# EAGLE design galaxydriveV3.5 (EAGLE 9.5.2)
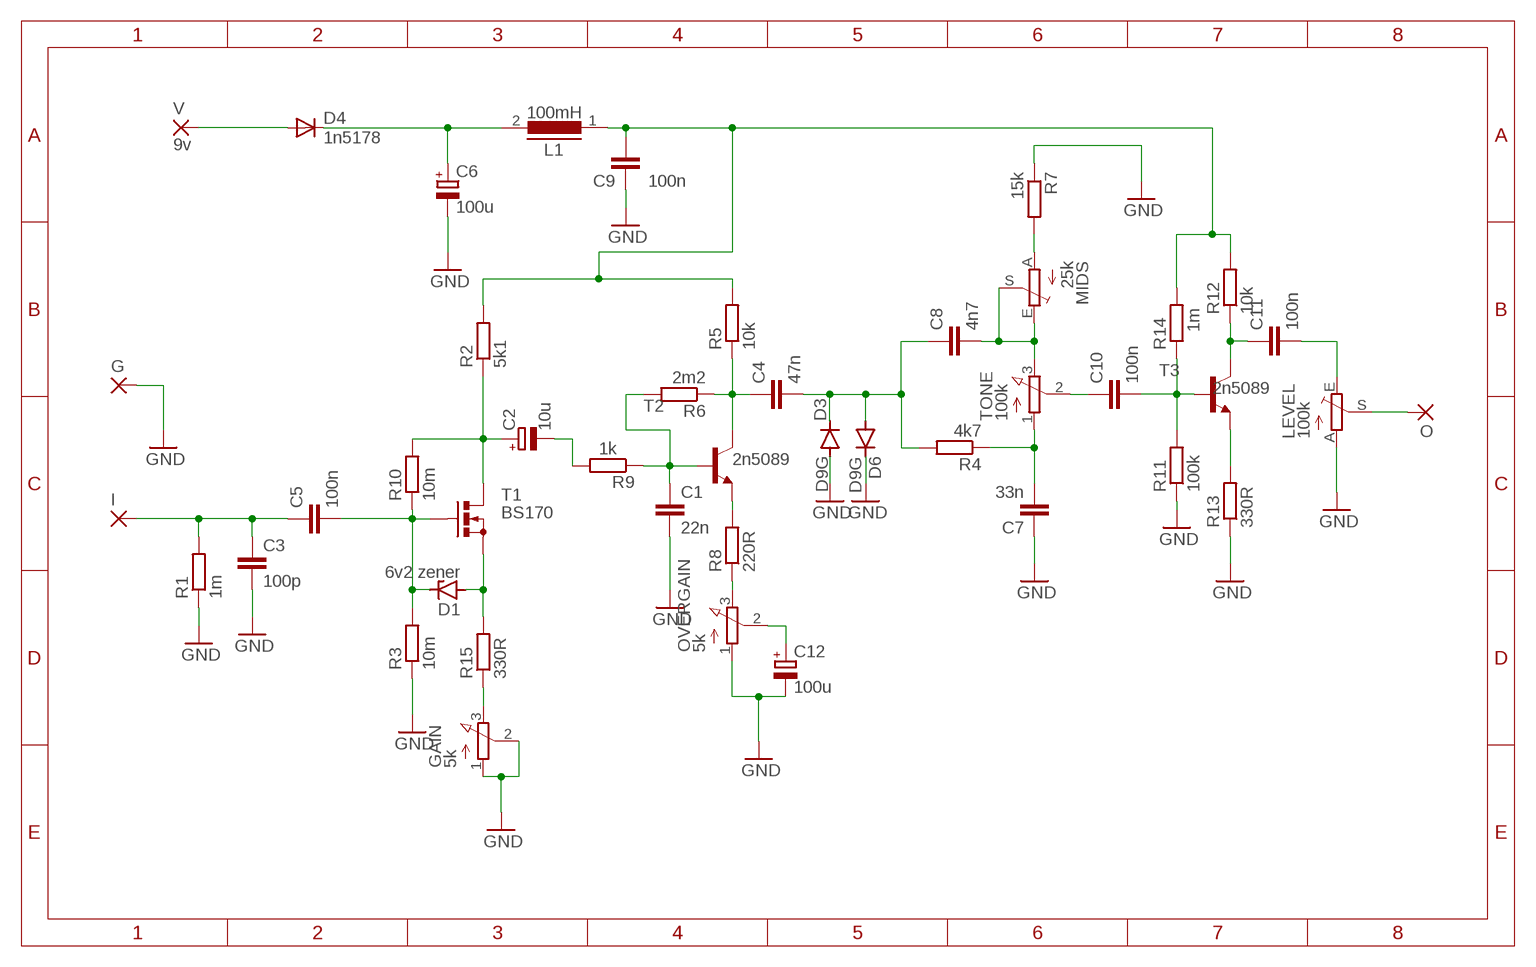
[diagram p0: schematic, sheet 1]

## Parts
C1  22n  C5/2.5  [C5B2.5]
C2  10u  CPOL-EUE1.8-4  [E1,8-4]
C3  100p  C5/2.5  [C5B2.5]
C4  47n  C5/2.5  [C5B2.5]
C5  100n  C5/2.5  [C5B2.5]
C6  100u  CPOL-EUE2-4  [E2-4]
C7  33n  C5/2.5  [C5B2.5]
C8  4n7  C5/2.5  [C5B2.5]
C9  100n  C5/2.5  [C5B2.5]
C10  100n  C5/2.5  [C5B2.5]
C11  100n  C5/2.5  [C5B2.5]
C12  100u  CPOL-EUE2-4  [E2-4]
D1  6v2 zener  BZX90  [DO34Z7]
D3  D9G  OA91  [DO07]
D4  1n5178  DIODE-D-7.5  [D-7.5]
D6  D9G  OA91  [DO07]
G  2,15/1,0  [2,15/1,0]
GAIN  5k  HEXPOT1  [3RP/1610N]
I  2,15/1,0  [2,15/1,0]
L1  100mH  MCC10  [MCC10]
LEVEL  100k  TRIM_EU-B25P  [B25P]
MIDS  25k  TRIM_EU-B25P  [B25P]
O  2,15/1,0  [2,15/1,0]
OVERGAIN  5k  HEXPOT1  [3RP/1610N]
R1  1m  R-EU_0207/7  [0207/7]
R2  5k1  R-EU_0207/7  [0207/7]
R3  10m  R-EU_0207/7  [0207/7]
R4  4k7  R-EU_0207/7  [0207/7]
R5  10k  R-EU_0207/7  [0207/7]
R6  2m2  R-EU_0207/7  [0207/7]
R7  15k  R-EU_0207/7  [0207/7]
R8  220R  R-EU_0207/7  [0207/7]
R9  1k  R-EU_0207/7  [0207/7]
R10  10m  R-EU_0207/7  [0207/7]
R11  100k  R-EU_0207/7  [0207/7]
R12  10k  R-EU_0207/7  [0207/7]
R13  330R  R-EU_0207/7  [0207/7]
R14  1m  R-EU_0207/7  [0207/7]
R15  330R  R-EU_0207/7  [0207/7]
T1  BS170  [SOT54E]
T2  2n5089  2N3904  [TO92]
T3  2n5089  2N3904  [TO92]
TONE  100k  HEXPOT1  [3RP/1610N]
V  9v  2,15/1,0  [2,15/1,0]

## Nets
GND: C1.2 C3.2 C6.- C7.1 C9.1 C12.- D3.A D6.C G.1(P) GAIN.1(A) GAIN.2(S) LEVEL.A OVERGAIN.1(A) R1.1 R3.1 R7.1 R11.1 R13.1
N$1: C2.+ R2.1 R10.2 T1.D
N$2: C4.2 C8.1 D3.C D6.A R4.2
N$3: C5.2 D1.C R3.2 R10.1 T1.G
N$4: D1.A R15.2 T1.S
N$5: C9.2 L1.1 R2.2 R5.2 R12.2 R14.2
N$6: C2.- R9.2
N$7: C8.2 MIDS.E MIDS.S TONE.3(E)
N$8: R8.2 T2.3(E)
N$9: C7.2 R4.1 TONE.1(A)
N$10: C3.1 C5.1 I.1(P) R1.2
N$11: C10.2 R11.2 R14.1 T3.2(B)
N$12: OVERGAIN.3(E) R8.1
N$13: C12.+ OVERGAIN.2(S)
N$14: C1.1 R6.2 R9.1 T2.2(B)
N$15: C11.1 R12.1 T3.1(C)
N$16: C4.1 R5.1 R6.1 T2.1(C)
N$18: R13.2 T3.3(E)
N$19: MIDS.A R7.2
N$20: GAIN.3(E) R15.1
N$21: LEVEL.S O.1(P)
N$22: C10.1 TONE.2(S)
N$23: C11.2 LEVEL.E
N$27: C6.+ D4.C L1.2
N$28: D4.A V.1(P)

## Library data of the parts
C1 C3-C5 C7-C11 = hexcapacitor-wima:C: CAPACITOR naming: grid - package width
C2 C6 C12 = hexresistor:CPOL-EU: POLARIZED CAPACITOR, European symbol; SPICEPREFIX: C
D1 = diode:BZX90: Z DIODE
D3 D6 = diode:OA91: DIODE germanium signal diode 115 V 50 mA
D4 = diode-1:DIODE-: DIODE
G I O V = wirepad:2,15/1,0: THROUGH-HOLE PAD
GAIN OVERGAIN TONE = hexpedalpot:HEXPOT1: 16mm Potentiometer one level Source: http://www.alphapotentiometers.net/html/16mm_pot_2.html
L1 = inductors:MCC10: INDUCTOR; SPICEPREFIX: L
LEVEL MIDS = hexpedalpot16mm low pro:TRIM_EU-: POTENTIOMETER
R1-R15 = hexresistor:R-EU_: RESISTOR, European symbol; SPICEPREFIX: R
T1 = transistor-small-signal:BS170: N-CHANNEL MOS FET
T2 T3 = transistor:2N3904: NPN TRANSISTOR

## Net classes
0 default: width 0.254 mm

## Board
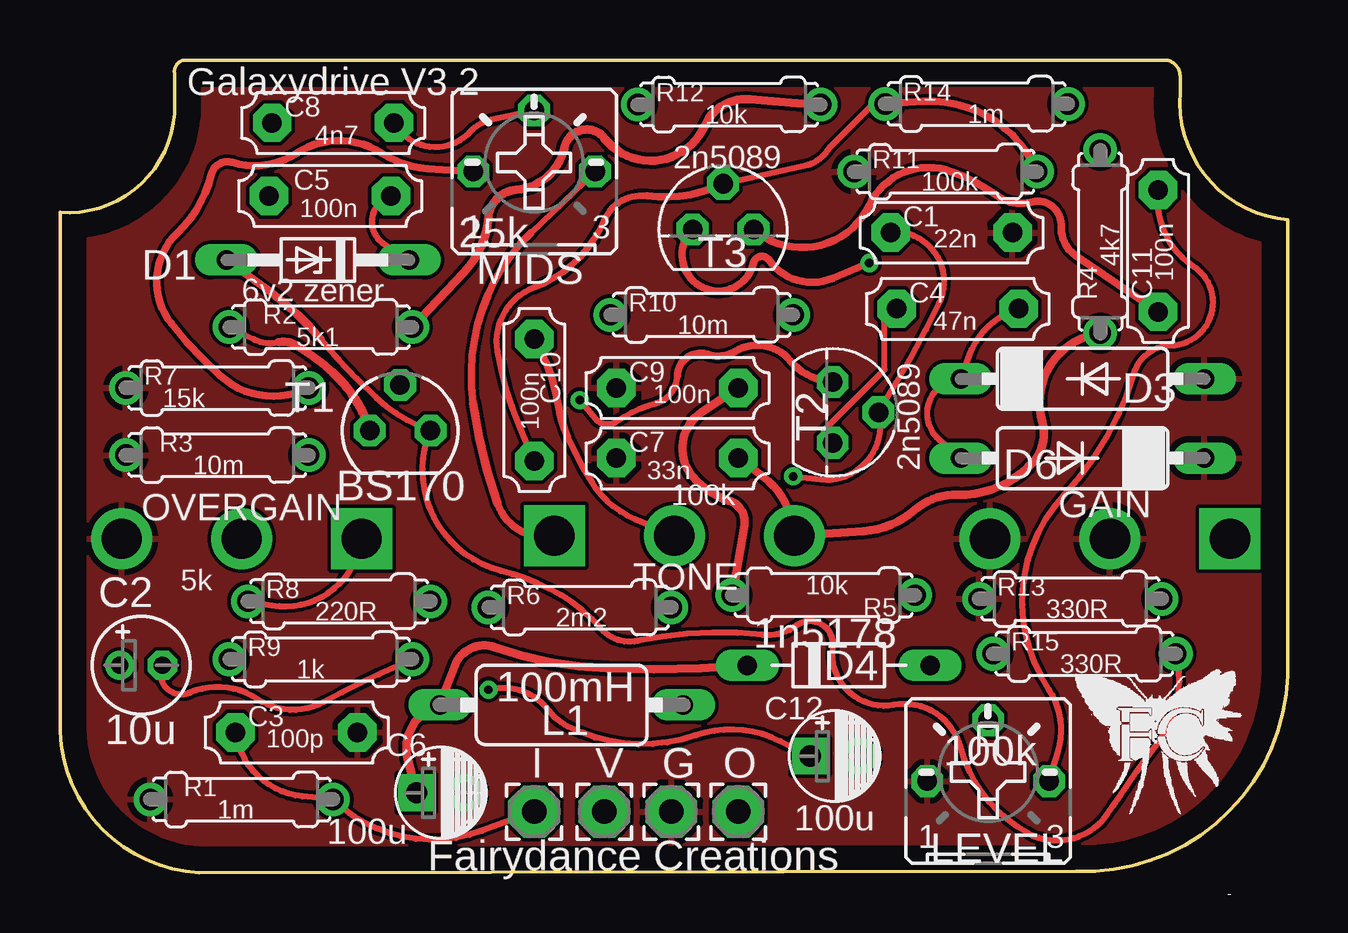
[diagram p1: board, top side]
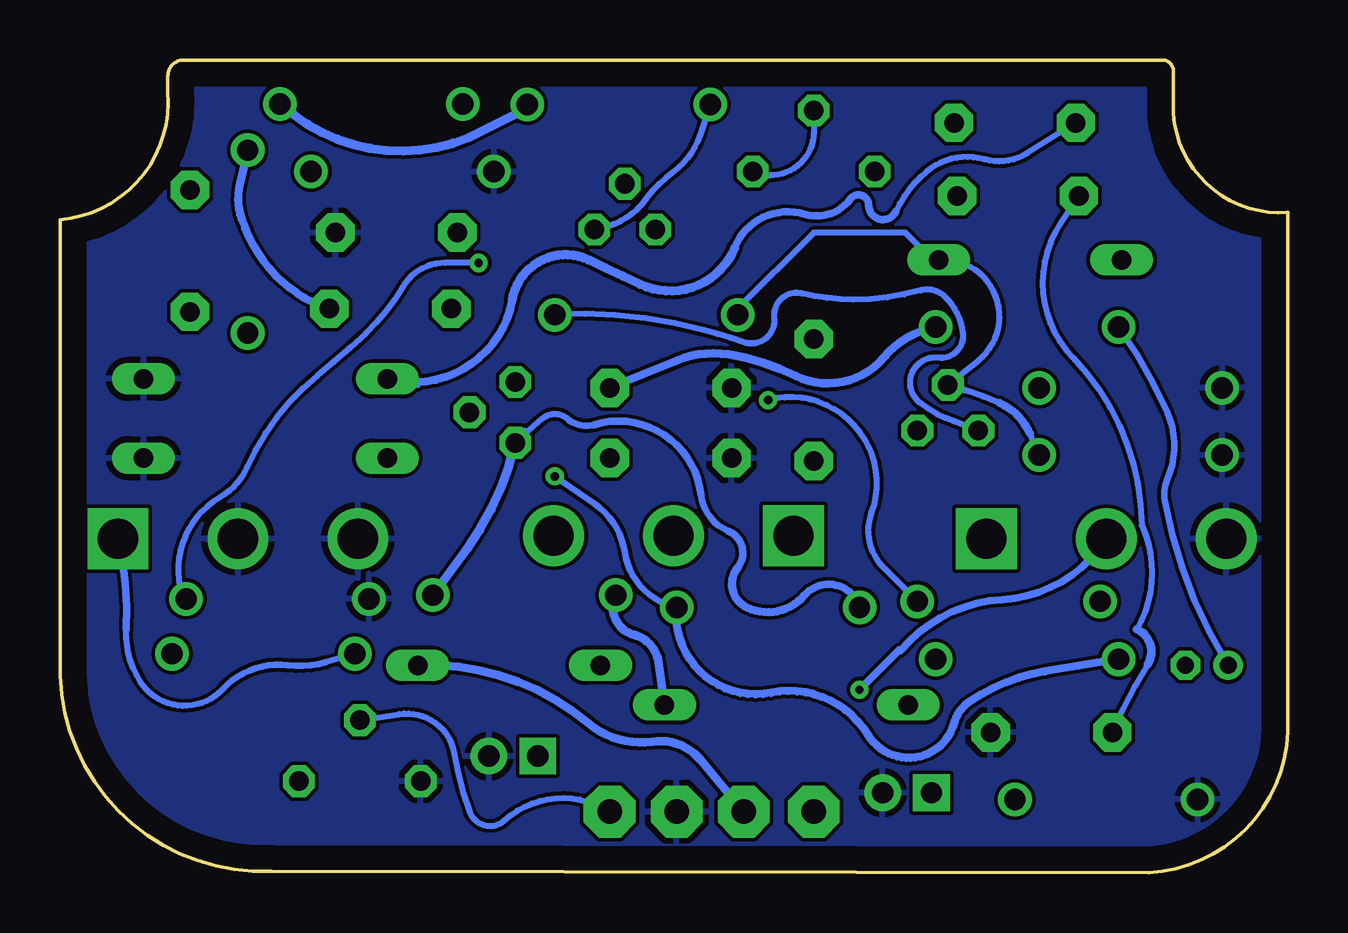
[diagram p2: board, bottom side, seen from below]

Size 51.18 x 33.86 mm. Coordinates in mm from the lower left corner, seen from the top.
Outline: 0,6.43 arc90 5.79,0 42.37,0.05 arc90 51.18,8.2 51.18,27.2 arc-90 46.69,32.51 46.69,33.15 arc90 46.05,33.86 5.16,33.86 arc90 4.78,33.27 4.78,31.62 arc-90 0,27.51 0,6.43
Copper layers (1*16): Top 0.035mm / dielectric 1.5mm / Bottom 0.035mm
Design rules "default": minimum track width 6mil, minimum drill 0.35mm, track to track 6mil, track to pad 6mil, pad to pad 6mil, via to via 6mil, smd to smd 6mil, copper to edge 40mil, drill to drill 6mil, minimum pad ring 10mil, minimum via ring 8mil, stop-mask expansion 4mil, vias tented up to drill 0mil, thermal gap 10mil

### Footprints (pad centres in the part's own frame; a part is rotated, then mirrored left to right if it is on the bottom)
C5B2.5 = drill 0.813 pad 1.6 octagon: 1 -2.54,0; 2 2.54,0
E1,8-4 = drill 0.711 pad 1.168: + -0.889,0 | drill 0.711 pad 1.168 octagon: - 0.889,0
E2-4 = drill 0.889 pad 1.524 square: + -1.016,0 | drill 0.889 pad 1.524: - 1.016,0
DO34Z7 = drill 0.813 long: A 3.81,0; C -3.81,0
DO07 = drill 0.813 long: A 5.08,0; C -5.08,0
D-7.5 = drill 0.813 long: A 3.81,0; C -3.81,0
2,15/1,0 = drill 1.016 pad 2.159 octagon: 1 0,0
3RP/1610N = drill 1.676 pad 2.54: 1 -5,0; 2 0,0 | drill 1.676 pad 2.54 square: 3 5,0
MCC10 = drill 0.813 long: 1 -5.08,0; 2 5.08,0
B25P = drill 0.813 octagon: A -2.54,0; E 2.54,0; S 0,2.54
0207/7 = drill 0.889: 1 -3.81,0; 2 3.81,0
SOT54E = drill 0.813 octagon: D -1.27,0; G 0,1.905; S 1.27,0
TO92 = drill 0.813 octagon: 1 1.27,0; 2 0,1.905; 3 -1.27,0

### Placement (x,y rotation side)
C1  37.16,26.67 0 top
C2  3.38,8.64 0 top
C3  9.86,5.84 0 top
C4  37.42,23.49 0 top
C5  11.26,28.19 0 top
C6  15.88,3.33 0 top
C7  25.73,17.27 0 top
C8  11.38,31.24 0 top
C9  25.73,20.19 0 top
C10  19.76,19.68 270 top
C11  45.77,25.91 90 top
C12  32.29,4.85 0 top
D1  10.75,25.53 180 top
D3  42.62,20.57 0 top
D4  32.46,8.64 0 top
D6  42.62,17.27 180 top
G  25.48,2.54 0 top
GAIN  43.77,13.91 0 top
I  19.76,2.54 0 top
L1  20.91,6.99 180 top
LEVEL  38.69,3.81 0 top
MIDS  19.76,29.21 0 top
O  28.27,2.54 0 top
OVERGAIN  7.57,13.91 0 top
R1  7.57,3.05 0 top
R2  10.87,22.73 0 top
R3  6.56,17.4 0 top
R4  43.36,26.29 90 top
R5  31.83,11.56 180 top
R6  21.67,11.05 0 top
R7  6.56,20.19 0 top
R8  11.64,11.3 0 top
R9  10.87,8.89 0 top
R10  26.75,23.24 0 top
R11  36.91,29.21 0 top
R12  27.89,32 0 top
R13  42.12,11.4 0 top
R14  38.2,32.03 0 top
R15  42.7,9.12 0 top
T1  14.18,18.41 0 top
T2  32.21,19.18 270 top
T3  27.64,26.8 0 top
TONE  25.61,14.03 180 top
V  22.69,2.54 0 top

### Tracks (layer width: path | path; a pad name or v marks a point on that pad's centre or on a via)
GND
  pour Bottom: -0.3,28.07 -0.3,5.99 arc90 5.85,-0.15 47.25,-0.15 arc90 51.44,4.04 51.44,27.25 arc-90 47.32,31.37 47.32,33.95 5.58,33.95 arc-90
  pour Top: -0.23,2.84 -0.23,24.97 4.45,33.34 47.61,33.34 51.51,25.53 51.51,2.29 49.23,0 2.62,0
N$1
  Top 0.254: R2.1 8.08,22.22 arc39 9.1,22.1
  Top 0.33: 9.1,22.1 arc-44 9.86,21.97
  Top 0.356: 9.86,21.97 arc-11 11.38,20.83
  Top 0.381: 11.38,20.83 arc-30 T1.D
  Bottom 0.254: 2.62,8.89 C2.+ | 7.06,22.22 R2.1 | 30.56,22.86 R10.2 arc18 24.34,22.61 arc4 22.69,22.1 arc-116 21.42,23.11 arc110 20.27,24.13 arc-13 18.11,23.88 arc-16 15.32,24.26 arc60 14.3,24 arc39 13.54,22.48 arc104 14.56,21.46 arc-150 15.32,19.56 arc-16 13.92,18.8 T1.D
  Bottom 0.279: C2.+ 2.57,8.77 arc21 5.14,15.5 arc34 5.03,16.38 arc-48 5.03,19.18 arc-12 R2.1
N$2
  Top 0.254: D6.A 36.66,18.03 arc-137 D3.C 37.93,21.59 arc-53 C4.2
  Bottom 0.254: 39.45,23.49 C4.2 | 36.27,20.32 37.54,20.32 D3.C | C8.1 10.87,29.97 arc48 12.65,29.72 arc-55 15.07,29.21 arc-26 16.34,27.56
  Bottom 0.305: 16.34,27.56 arc156 17.48,27.81 arc-144 18.24,28.07 arc70 20.15,27.43 arc-84 23.07,26.04
  Bottom 0.33: 32.34,23.88 arc95 D3.C | R4.2 43.69,28.68 arc-32 43.62,27.23 arc-13 42.93,25.81 arc-20 41.63,24.38 arc-20 C4.2
  Bottom 0.381: 23.07,26.04 arc93 27,24.51 arc-1 29.16,25.53 arc-105 32.34,23.88
N$3
  Top 0.254: 14.05,26.04 D1.C 13.54,26.16 arc-130 C5.2
  Bottom 0.254: R10.1 22.94,23.49 19.76,26.67 15.95,26.67 14.68,25.4 D1.C | 14.05,26.04 D1.C | R3.2 10.75,18.29 | 12.02,19.56 arc-8 T1.G 12.91,21.34 arc-146 D1.C
  Bottom 0.33: 10.75,18.29 arc-44 12.02,19.56
N$4
  Top 0.254: 10.87,22.22 arc7 13.16,19.81 arc23 T1.S arc98 18.37,12.57 arc-8 19.89,12.07 arc-26 22.56,10.16 arc61 24.08,9.65 arc-18 29.29,9.91 arc43 30.69,10.29 arc-134 32.21,9.4 arc108 34.75,6.99 arc-85 37.54,5.21 arc47 40.34,1.65 arc83 43.64,2.41 arc1 44.45,3.58 arc-3 45.8,5.46 arc52 R15.2
  Top 0.33: D1.A 8.84,24.13
  Top 0.356: 8.84,24.13 arc-14 10.87,22.22
N$5
  Top 0.356: C9.2 26.75,19.18 arc96 26.37,16.51 arc33 27.89,15.49 arc-81 28.53,14.48 arc-3 R5.2 | R2.2 16.84,25.02 arc39 17.86,27.3 arc-81 19,28.45 arc73 21.03,30.23 arc-130 22.69,30.61 arc117 26.88,31.11 arc-71 28.77,32.22 arc2 R12.2
  Bottom 0.254: 26.11,6.99 L1.1 | 14.68,22.22 R2.2 | 28.02,19.68 C9.2
  Bottom 0.356: L1.1 26.24,8.76 arc-67 27.26,9.91 arc101 R5.2 | C9.2 25.48,21.34 arc31 23.32,21.59 arc18 20.53,20.7 arc-76 16.84,21.46 arc39 R2.2
  Bottom 0.381: R12.2 31.89,31.76 34.14,30.63 arc65 41.99,32.04 R14.2
N$6
  Top 0.254: R9.2 13.29,8.25 arc4 11,7.11 arc-63 8.21,7.24 arc57 5.41,7.49 arc-137 C2.-
N$7
  Top 0.254: MIDS.S 17.99,31.37 arc35 17.1,30.86 arc-108 C8.2 | MIDS.E 19.64,26.67
  Top 0.305: 19.64,26.67 arc28 17.61,23.49 arc27 17.22,19.56 | 18.24,15.37 arc82 TONE.3
  Top 0.356: 17.22,19.56 arc12 18.24,15.37
  Bottom 0.254: MIDS.S 19.76,30.86 arc114 MIDS.E
N$8  (via drill 0.35)
  Top 0.254: v21.67,19.68 22.3,18.92 arc84 23.19,18.8 arc-18 24.84,19.56 arc73 25.73,20.7
  Top 0.305: 25.73,20.7 arc-107 27,21.59 arc50 28.15,21.72 arc-82 30.43,21.34 arc47 T2.3
  Bottom 0.254: R8.2 16.84,12.7 arc65 17.35,14.99 arc-125 v21.67,19.68
N$9
  Top 0.33: C7.2 29.29,16.51 arc-50 TONE.1
  Top 0.356: TONE.1 33.48,14.22 arc37 35.64,15.11 arc-43 37.42,15.75 arc51 40.59,17.14 arc57 40.94,18.76 arc-99 R4.1
N$10
  Top 0.254: 10.87,3.17 R1.2 | R1.2 10.11,3.17 arc-76 C3.1 | I.1 17.58,1.74 arc-64 R1.2
  Bottom 0.254: 7.06,6.35 C3.1 arc9 5.84,8.68 | 11.51,2.54 R1.2 | C5.1 9.48,27.05 arc-78 8.97,21.46 arc44 6.1,14.47 arc54 6.3,10.14
  Bottom 0.356: 6.3,10.14 arc98 5.84,8.68
N$11
  Top 0.254: 27.38,28.57 27.59,28.68 T3.2 31.07,29.46 arc49 32.08,30.23 34.13,32.27 arc38 R14.1 | C10.2 19.13,18.67 arc-13 18.24,21.72 arc-79 19.76,24.38
  Top 0.279: 19.76,24.38 arc46 22.69,27.18 arc-74 24.46,28.19
  Top 0.305: R14.1 35.99,32.13 arc-71 R11.2 | 24.46,28.19 arc32 27.59,28.68
N$12
  Top 0.254: 8.33,11.43 R8.1 8.83,11.14 arc92 OVERGAIN.3
N$13  (via drill 0.35)
  Top 0.254: C12.+ 30.01,5.48 arc46 26.5,5.71 arc-46 21.16,6.1 arc-25 20.4,6.73 arc66 v17.86,7.62
  Bottom 0.305: v17.86,7.62 16.2,9.28 16.16,9.25 arc46 11.9,11.37 arc-54 OVERGAIN.2
N$14  (via drill 0.35)
  Top 0.254: C1.1 arc-121 36.66,23.75 arc-5 34.88,20.45 T2.2 arc-111 31.7,16.38 v30.56,16.51
  Bottom 0.279: v30.56,16.51 28.91,15.37 arc47 27.64,13.34 arc-69 R6.2
  Bottom 0.33: R9.1 10.11,8.38 arc-25 13.29,7.11 arc-41 13.92,6.22 arc133 17.48,5.71 arc-70 21.54,7.49 arc107 R6.2
N$15
  Top 0.305: C11.1 42.35,25.7 arc-58 41.74,26.92 arc108 40.47,27.94 arc-51 39.07,28.19 arc16 37.16,29.21 arc85 33.73,27.81 arc-105 T3.1
  Bottom 0.254: R12.1 24.51,30.71 arc35 25.61,29.21 arc-17 26.75,28.07 arc46 T3.1
N$16
  Top 0.254: C4.1 34.37,23.49 34.37,20.95 31.83,18.41 T2.1
  Bottom 0.254: 35.64,12.07 R5.1 | 31.83,18.41 T2.1 31.07,18.92 arc83 30.05,18.92
  Bottom 0.279: 30.05,18.92 arc-58 28.91,18.67 | 24.46,15.75 arc-60 23.32,14.22
  Bottom 0.305: 28.91,18.67 arc100 24.46,15.75 | 23.32,14.22 arc106 22.94,12.7 | 20.15,11.56 arc123 R6.1
  Bottom 0.33: 22.94,12.7 arc-104 22.56,11.05 arc-74 20.15,11.56
  Bottom 0.381: R5.1 34.24,13.46 arc-23 T2.1
N$18  (via drill 0.35)
  Top 0.305: v33.73,25.4 32.21,24.77 arc-77 29.54,25.53 arc132 28.91,25.4 arc-212 T3.3
  Bottom 0.254: v33.73,25.4 35.13,25.4 arc-59 36.91,24.38 arc16 38.43,22.48 arc4 40.47,20.7 arc-27 43.39,16.89 arc36 44.53,15.62 arc-67 46.23,12.22 arc-28 R13.2
N$19
  Top 0.254: 10.24,20.32 R7.2
  Top 0.305: MIDS.A 15.32,29.34 arc-29 13.41,29.97 arc66 9.86,29.97 arc-50 7.19,29.59 arc93 6.3,29.08 arc-33 4.91,26.67 arc85 4.65,22.86 arc9 6.68,20.7 arc69 R7.2
N$20
  Bottom 0.254: R15.1 40.11,8.76 | 44.4,7.65 arc104 47.83,7.95 arc36 48.42,10.13
  Bottom 0.279: 40.11,8.76 arc23 41.68,8.64 arc-54 44.4,7.65
  Bottom 0.305: 48.42,10.13 arc-16 GAIN.3
N$21
  Bottom 0.254: LEVEL.S 37.04,6.6 arc89 34.75,4.95 arc-10 34.12,2.54 arc-112 32.65,2.17 arc75 O.1
N$22
  Top 0.254: 25.48,13.97 TONE.2 23.96,14.73 arc-35 22.18,16.26
  Top 0.279: 22.18,16.26 arc-7 21.16,18.16
  Top 0.305: 21.16,18.16 arc-15 20.78,19.43 arc22 C10.1
N$23
  Top 0.254: LEVEL.E 41.61,5.08 arc50 41.23,7.62 arc-76 41.86,15.75 arc26 44.78,20.83 arc-72 46.31,21.97 arc146 47.26,25.24 arc-63 C11.2
N$27
  Top 0.356: C6.+ 14.5,4.67 arc-89 L1.2 16.46,8.64 arc-88 18.11,9.4 arc17 22.81,8.51 arc7 D4.C
N$28
  Bottom 0.254: 36.27,8.25 D4.A
  Bottom 0.356: V.1 24.47,4.68 arc-58 26.5,5.46 arc48 29.16,6.22 arc-43 D4.A

### Text on the board
tNames: Galaxydrive V3.2 | 2n5089 | 6v2 zener | 100n | 2n5089 | Fairydance Creations